# Altium project Arduino Power Regulator with LED.PrjPcb
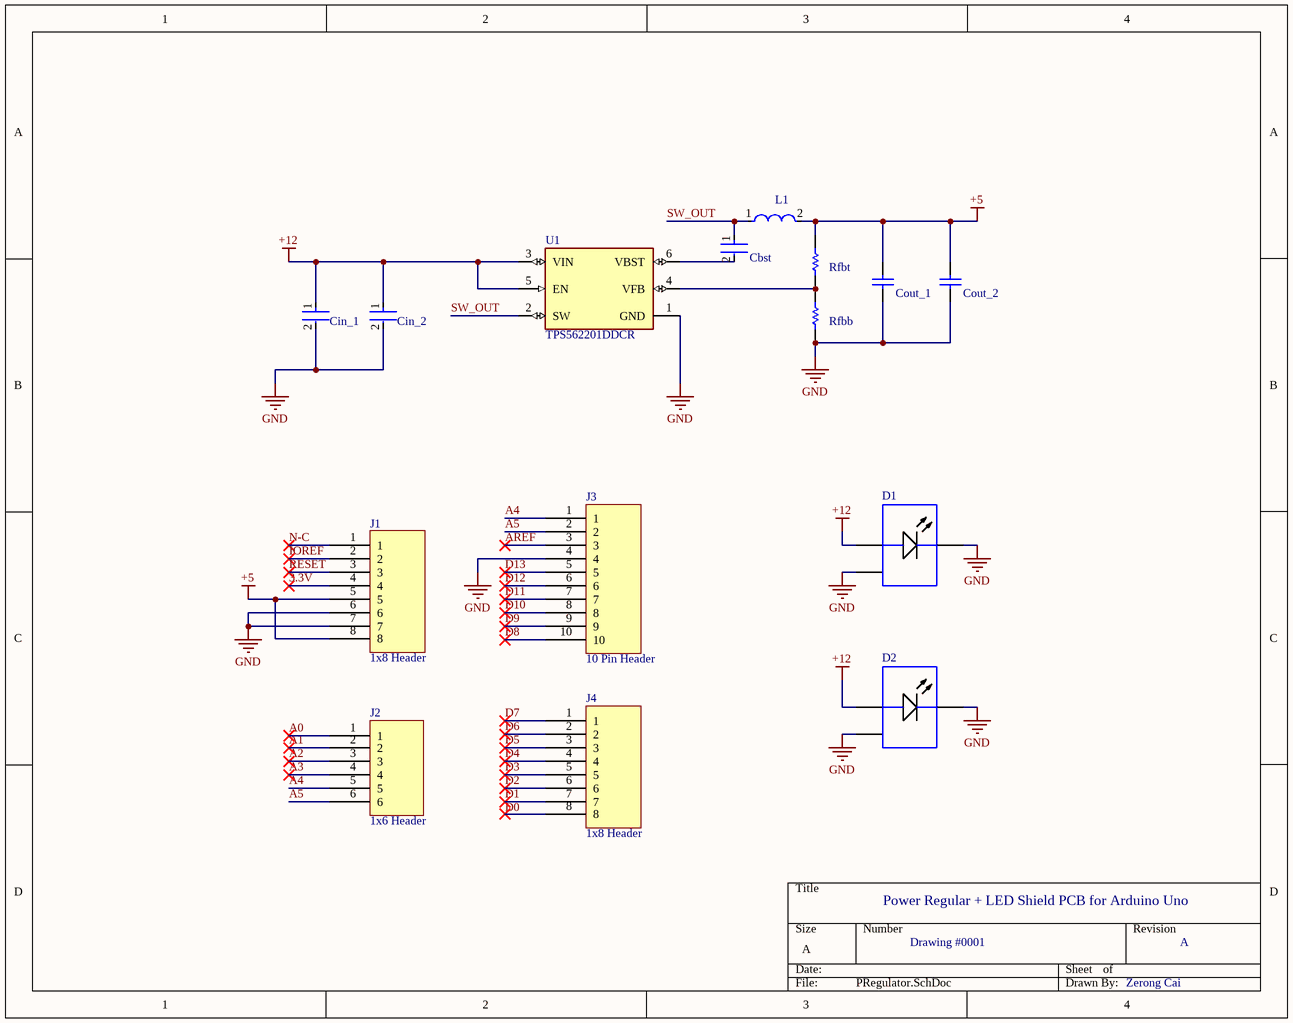
[diagram p0: PRegulator.SchDoc]
1 sheet, 15 parts. Net scope: global (net labels, ports and power ports of the same name join across sheets).
Board file: Power_Regulator.PcbDoc

## Sheet PRegulator.SchDoc
size A; SheetNumber: 1; SheetTotal: 1

### Parts
Cbst  08053C104KAT2A  [FP-0805-L_2_01_0_2-W_1_25-IPC_C]  (value not drawn)
Cin_1  C2012X5R1V106K125AC  [FP-C2012-125-0_2-IPC_B]  (value not drawn)
Cin_2  C2012X5R1V106K125AC  [FP-C2012-125-0_2-IPC_B]  (value not drawn)
Cout_1  C1608X5R1A226M080AC  [CAPC1608X100X20ML10]  (value not drawn)
Cout_2  C1608X5R1A226M080AC  [CAPC1608X100X20ML10]  (value not drawn)
D1  MKRAWT-00-0000-0D0HG235H  [CREE-MK-R-2_V]  (value not drawn)
D2  MKRAWT-00-0000-0D0HG235H  [CREE-MK-R-2_V]  (value not drawn)
J1  1x8 Header  [1x8Header]
J2  1x6 Header  [1x6Header]
J3  10 Pin Header  [10 Pin Header-Footprint-1]
J4  1x8 Header  [1x8Header]
L1  NRS8030T3R3MJGJ  [FP-NRS8030-MFG]  (value not drawn)
Rfbb  ERJ2RKF1002X  [RESC1005X40X25LL05T05]  (value not drawn)
Rfbt  CRCW020156K2FNED  [RESC0603X28X15NL05T05]  (value not drawn)
U1  TPS562201DDCR  [FP-DDC0006A-IPC_C]

### Nets
+5: Cout_1.2 Cout_2.2 J1.5 J1.8 L1.2 Rfbt.2
+12: Cin_1.1 Cin_2.1 D1.1(A) D2.1(A) U1.3(VIN) U1.5(EN)
GND: Cin_1.2 Cin_2.2 Cout_1.1 Cout_2.1 D1.2(K) D1.3(EP) D2.2(K) D2.3(EP) J1.6 J1.7 J3.4 Rfbb.1 U1.1(GND)
3.3V: J1.4
A0: J2.1
A1: J2.2
A2: J2.3
A3: J2.4
A4: J2.5 J3.1
A5: J2.6 J3.2
AREF: J3.3
D1: J4.7
D2: J4.6
D3: J4.5
D4: J4.4
D5: J4.3
D6: J4.2
D7: J4.1
D8: J3.10
D9: J3.9
D10: J3.8
D11: J3.7
D12: J3.6
D13: J3.5
IOREF: J1.2
N-C: J1.1
RESET: J1.3
SW_OUT: Cbst.1 L1.1 U1.2(SW)
NetCbst_2: Cbst.2 U1.6(VBST)
NetRfbb_2: Rfbb.2 Rfbt.1 U1.4(VFB)

Not connected (* = marked no-connect by the designer): J4 8*

### Notes on the sheet
- Power Regular + LED Shield PCB for Arduino Uno
- Battery as Vin and Current source as Vout from generated schematic is replaced with power net ports (add a net name to denote the output point)
- Drawing #0001
- A
- Zerong Cai
- Labels drawn without touching a wire or pin: D0

### Library data of the parts
Cbst = CMP-2000-05014-2: General Purpose Ceramic Capacitor, 0805, 100nF, 10%, X7R, 0.15, 25V; Dissipation Factor: 3%; Insulation Resistance: 100GR; Tolerance: 10%; Height: 0.94mm; Case/Package: 0805; Case Code (Imperial): 0805; Number of Pins: 2; Termination: SMD/SMT; Case Code (Metric): 2012; Depth: 1.25mm; Min Operating Temperature: -55°C; Radiation Hardening: No; Max Operating Temperature: 125°C; Length: 2.01mm; Thickness: 0.037inch; Series: -; Dielectric: X7R; Voltage Rating (DC): 25V; Packaging: Tape and Reel; Width: 0.049inch; Capacitance: 100nF; Construction: Flat; Voltage: 25V; RoHS Compliant: Yes; REACH SVHC: No SVHC; Package Quantity: 1; Voltage Rating: 25V; Mount: Surface Mount; Lead Free: Lead Free; Contact Plating: Tin
Cin_1 Cin_2 = CMP-08246-003469-1: Multilayer Ceramic Capacitors 10μF ±10% 35V X5R SMD 0805; Capacitance: 10uF; Packaging: Tape and Reel; RoHS Compliant: Yes; Mount: Surface Mount; Series: C; Case/Package: 0805; Voltage Rating (DC): 35V; Lead Free: Lead Free; Weight: 0.000194oz; Max Operating Temperature: 85°C; Tolerance: 10%; Thickness: 0.057inch; Voltage Rating: 35V; Height: 1.25mm; Length: 0.079inch; Dielectric Material: Ceramic; Case Code (Imperial): 0805; Dielectric: X5R; Case Code (Metric): 2012; Min Operating Temperature: -55°C; Termination: SMD/SMT; Package Quantity: 2000; Width: 1.25mm; REACH SVHC: No SVHC
Cout_1 Cout_2 = CMP-2000-05441-1: Chip Capacitor, 22 uF, +/- 20%, 10 V, -55 to 85 degC, 0603 (1608 Metric), RoHS, Tape and Reel; Manufacturer: TDK; PCN Part Number: MLCCPartNumberChange30/Nov/2012; Voltage - Rated: 10V; Product Training Modules: CSeriesGeneralApplicationsSEAT,CCV,andTVCLDesignToolsGuidetoReplacinganElectrolyticCapacitorwithanMLCC; Other Names: 445-9077-1; Design Resources: 20WNon-IsolatedBuckLEDDriverUsingPLLNK460KG; Online Catalog: CSeries,GeneralPurpose; Capacitance: 22µF; Temperature Coefficient: X5R; Kits: 445-9014-KIT-ND-KITMLCC100PF-22UF060310-50V; Packaging: CutTape(CT); Standard Package: 1; Package / Case: 0603(1608Metric); Lead Style: -; Features: -; Ratings: -; Operating Temperature: -55degC~85degC; Applications: GeneralPurpose; Package Reference: 603; Datasheet URL: http://download.siliconexpert.com/pdfs/2015/4/21/15/54/45/779/tdk_/manual/37024850441143360mlcc_commercial_general_en.pdf; Datasheet Version: Mar-15; Mounting Type: SurfaceMount,MLCC; Lead Spacing: -; Size / Dimension: 0.063"Lx0.031"W(1.60mmx0.80mm); Height - Seated (Max): -; Package Description: 2-Pin Surface Mount Device, Body 1.6 x 0.8 mm; Manufacturer URL: http://www.tdk.com/; RoHS Information: RoHSCertificate-MLCC; Tolerance: ±20%; Series: C; Thickness (Max): 0.035"(0.90mm); Family: CeramicCapacitors; Category: Capacitors
D1 D2 = CMP-2100-00977-1: LED, White, 12 V, 2-Pin SMD, RoHS, Tape and Reel
J1 J4 = 8 Pin Header: Supplier 1: Digikey; Supplier Part Number 1: SAM1206-08-ND
J2 = 6 Pin Header: SSQ-106-03-T-S; Supplier 1: Digikey; Supplier Part Number 1: SAM1206-06-ND
J3 = CMP-002-00073-3: SPQ-110-03-T-S; Source: 1x10_Header.SchLib; Design Item ID: 10 Pin Header
L1 = CMP-14484-000405-1: Inductor Power Shielded Wirewound 3.3uH 20% 100KHz Ferrite 4.2A 24.7mΩ DCR T/R; Current Rating: 4.3A; DC Resistance (DCR): 19mR; Self Resonant Frequency: 50MHz; Height: 3mm; Lead Free: Lead Free; Saturation Current: 4.2A; Termination: SMD/SMT; RoHS Compliant: Yes; Resistor Type: Wirewound; RMS Current (Irms): 4.3A; Series: NRS; Halogen Free: Halogen Free; Shielding: Shielded; Length: 8mm; Max DC Current: 4.2A; Height - Seated (Max): 0.118inch; Radiation Hardening: No; Min Operating Temperature: -25°C; Number of Pins: 2; Core Material: Ferrite; Inductance: 3.3uH; Package Quantity: 1000; REACH SVHC: No SVHC; Test Frequency: 100kHz; Tolerance: 20%; Case/Package: Nonstandard; Inductance Tolerance: 20%; Width: 0.315inch; Mount: Surface Mount; Depth: 8.2mm; Lead Pitch: 5.6mm; Packaging: Tape and Reel; Max Operating Temperature: 125°C
Rfbb = CMP-2000-07588-1: Chip Resistor, 10 KOhm, +/- 1%, 0.1 W, -55 to 155 degC, 0402 (1005 Metric), RoHS, Tape and Reel; Manufacturer: Panasonic; Power Rating: 100mW; Voltage Rating: 50V; Resistance: 10KOhm; Case\/Package: 0402; Temperature Coefficient: 100ppm\/degreesC; RoHSCompliant: True; Lead Free: LeadFree; Package Quantity: 1; Contact Plating: Tin; Length: 1mm; Radiation Hardening: No; REACH SVHC: NoSVHC; Max Operating Temperature: 155degC; Depth: 0.5mm; Case Code (Imperial): 0402; Military Standard: Not; Package Description: 2-Pin Surface Mount Device, Body 1 x 0.5 mm; Termination: SMD/SMT; Case Code (Metric): 1005; Height: 0.35mm; Packaging: TapeandReel; Voltage Rating (DC): 50V; Package Reference: 402; Number of Pins: 2; Tolerance: 1%; Mounting Technology: SurfaceMount; Width: 0.02inch; Mount: SurfaceMount; Datasheet URL: https://industrial.panasonic.com/cdbs/www-data/pdf/RDA0000/AOA0000C304.pdf; Composition: ThickFilm; Datasheet Version: 02/2017; Manufacturer URL: http://www.panasonic.com/; Max Power Dissipation: 100mW; Number of Terminations: 2; Min Operating Temperature: -55degC
Rfbt = CMP-2004-00723-1: 56.2kOhm, Tolerance = 1.0%, Power = 50 mW; Manufacturer: Vishay Dale; Part Number: CRCW020156K2FNED
U1 = CMP-04918-000361-1: IC REG BUCK ADJ 2A TSOT23-6; Switching Frequency: 580kHz; Max Input Voltage: 17V; Number of Outputs: 1; Output Voltage: 7V; Output Type: Adjustable; Quiescent Current: 400uA; Min Input Voltage: 4.5V; Mount: Surface Mount; Max Operating Temperature: 125°C; Lead Free: Lead Free; Operating Supply Voltage: 17V; Number of Pins: 6; RoHS Compliant: Yes; Contact Plating: Tin; Min Operating Temperature: -40°C; Case/Package: SOT; Max Output Current: 2A